# Altium schematic sheet saw.SchDoc: SAW Filter
size Letter; CheckedBy: J. Brinton; CompanyName: Signal Laboratories, Inc.; DrawnBy: J. Brinton; Engineer: J. Brinton; Address1: 3479 Edison Way; Address2: Menlo Park CA 94025; Address3: +1 (877) 778-8435; Address4: siglabs.com; Revision: 3; SheetNumber: 7; SheetTotal: 49; ModifiedDate: 4/20/2018
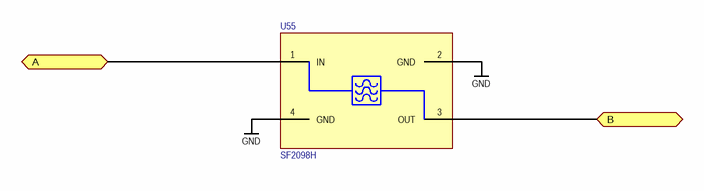
[diagram p0: saw.SchDoc]

## Parts
U55  SF2098H  [SM2016-4]

## Ports
A (bidir), B (bidir)

## Nets
GND: U55.2(GND) U55.4(GND)
A: U55.1(IN) ; port A
B: U55.3(OUT) ; port B

## Notes on the sheet
- Title
- Engineer
- Revision
- Drawn By
- Checked By
- Date
- Sheet
- of

## Library data of the parts
U55 = SF2098H: 915 MHz SAW Filter; Manufacturer: RFM; Manufacturer P/N: SF2098H